# Altium project PFC_Evaluation_Board.PrjPcb
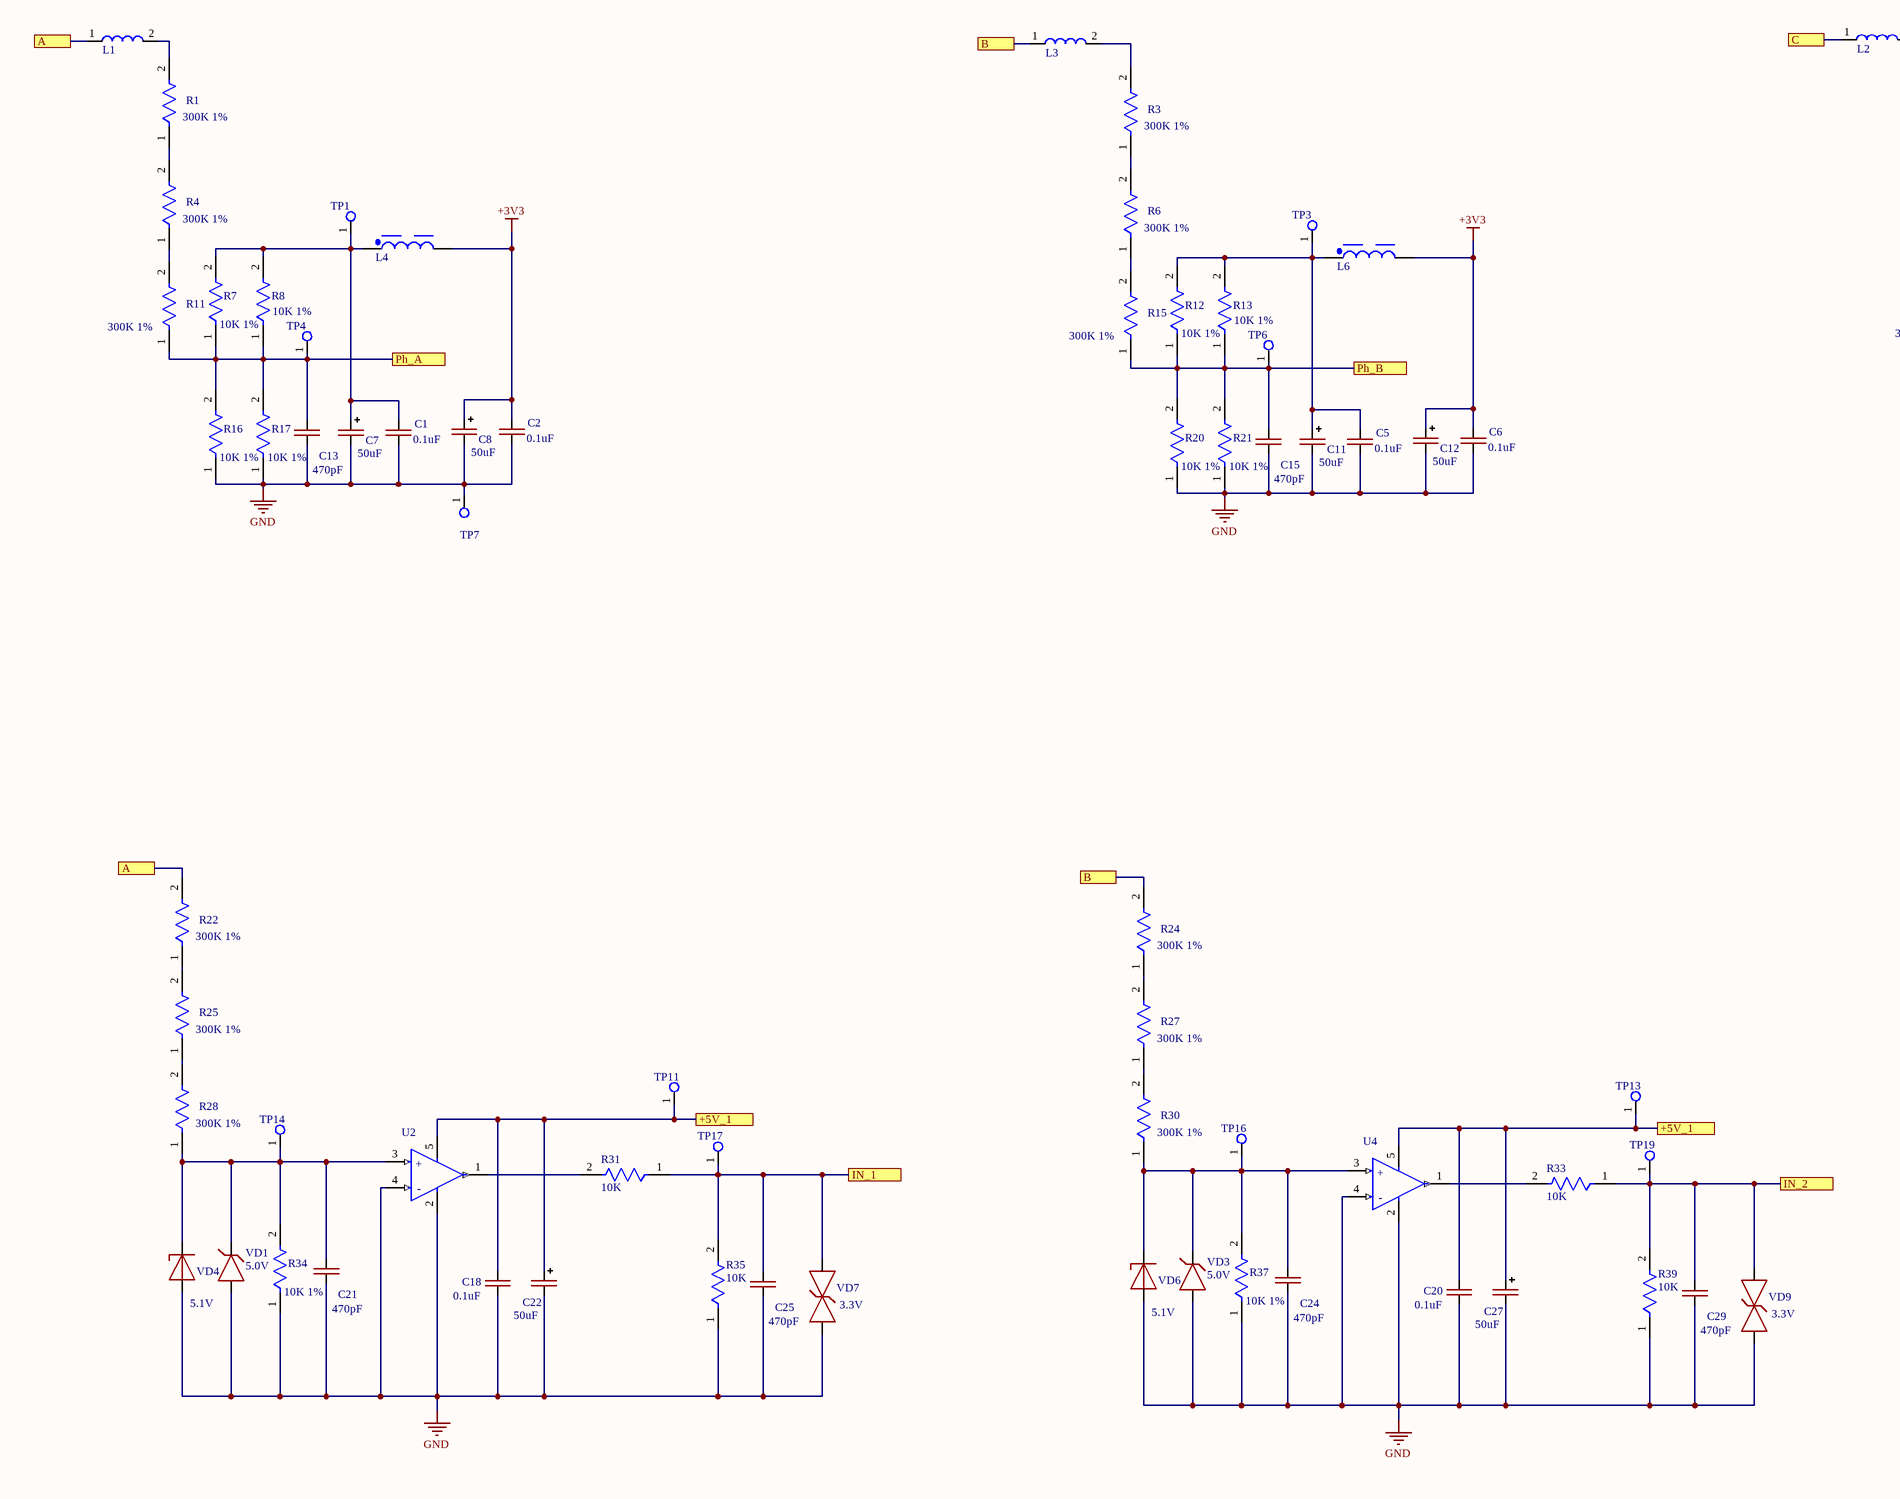
[diagram p0: Rectifire_(PFC)_Evaluation_Board.SchDoc, left]
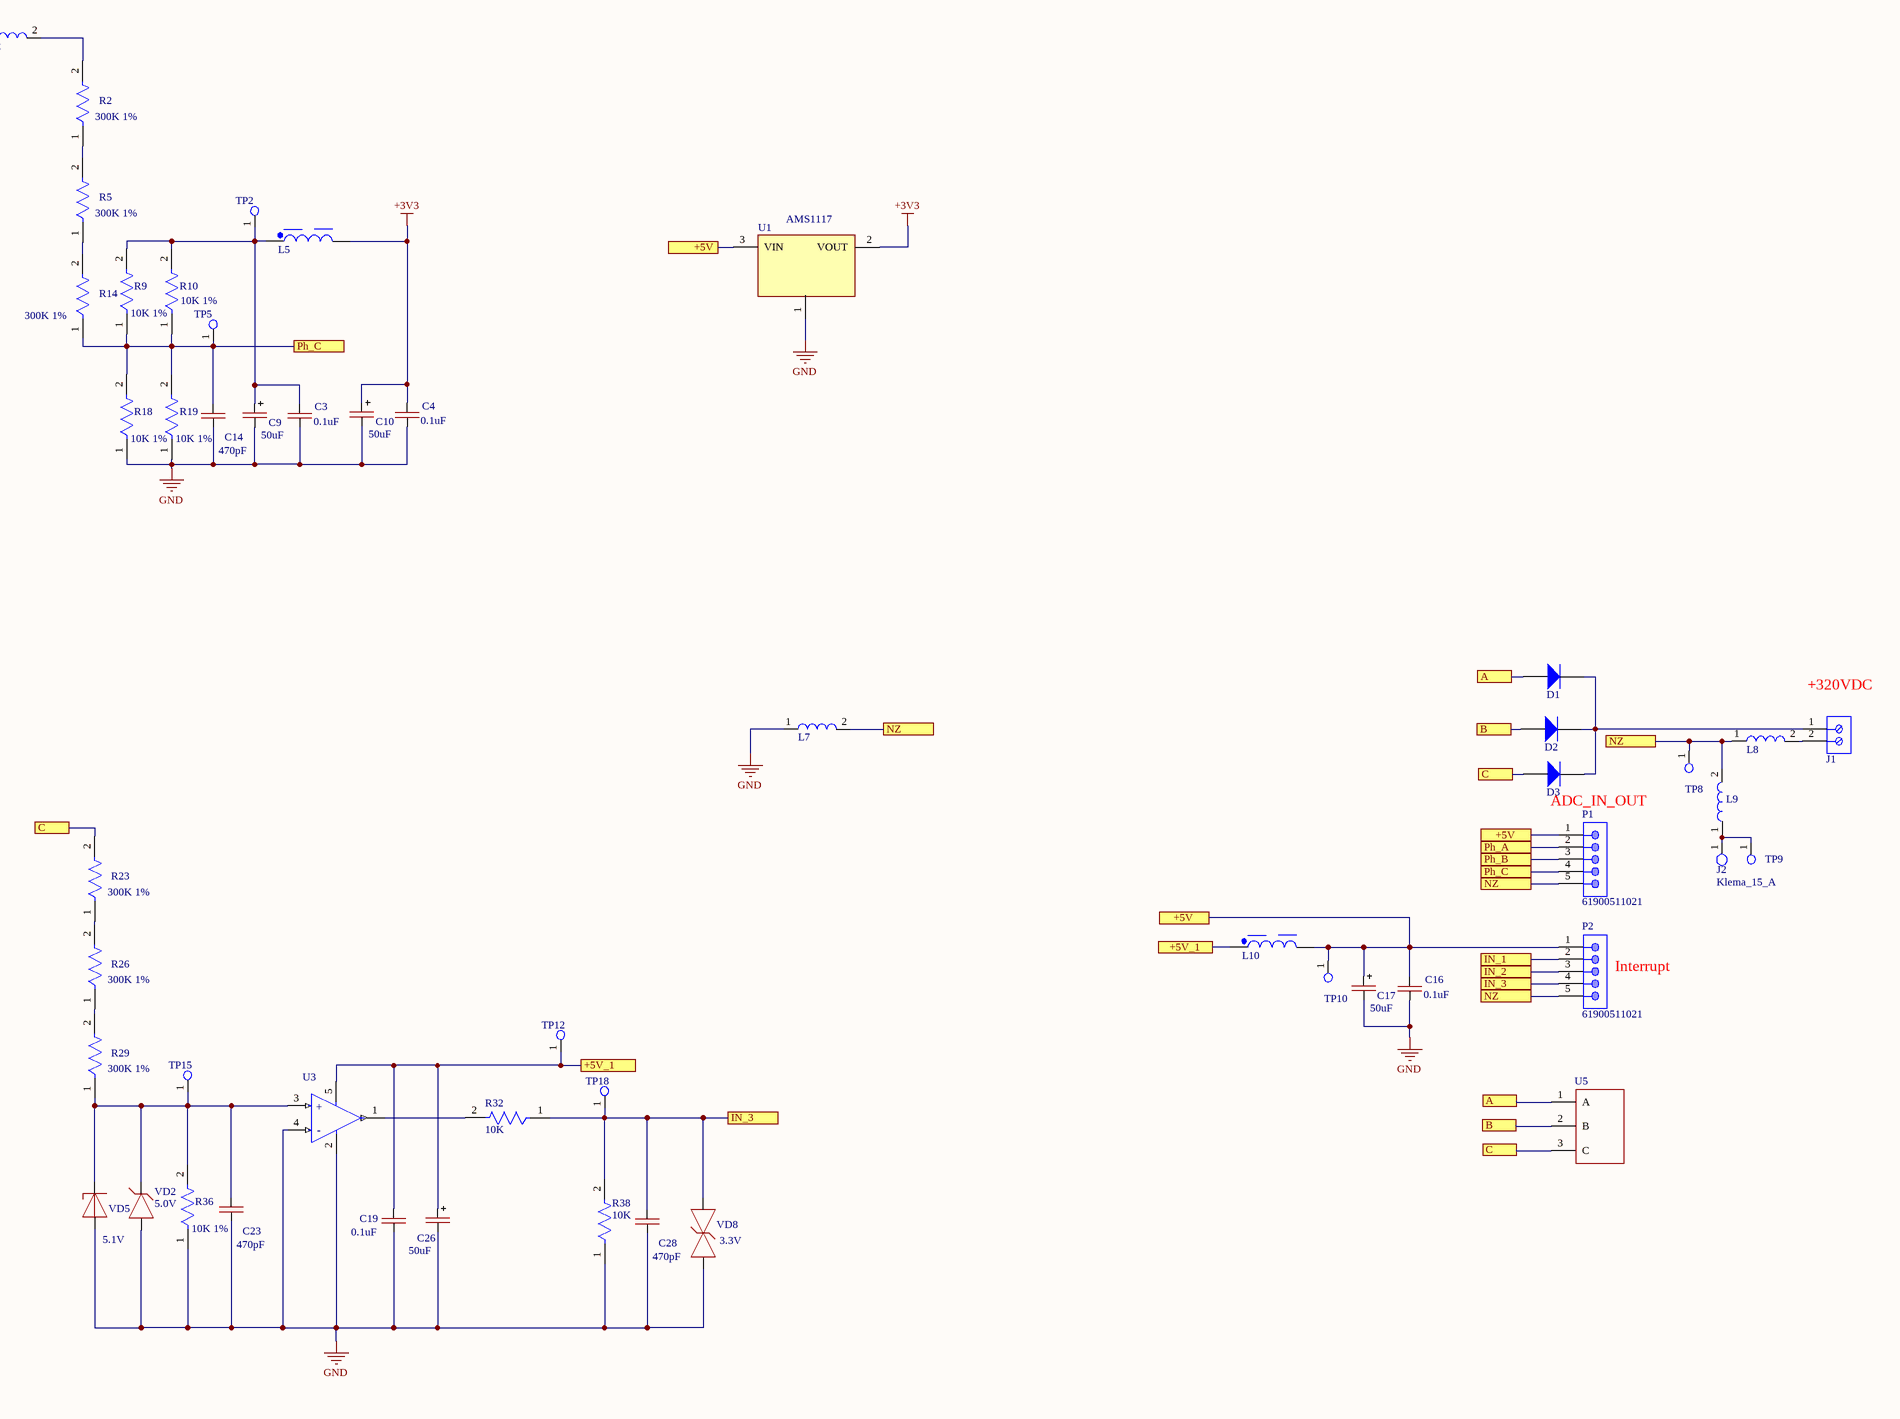
[diagram p1: Rectifire_(PFC)_Evaluation_Board.SchDoc, right]
1 sheet, 118 parts. Net scope: flat (ports and power ports of the same name join across sheets).
Board file: Rectifire_(PFC)_Evaluation_board.PcbDoc

## Sheet Rectifire_(PFC)_Evaluation_Board.SchDoc
size A1; SheetNumber: 1; SheetTotal: 1; SPICEModelCacheJLRIVHQE: <root> / <DocumentId>JLRIVHQE</DocumentId> / <CacheFrame Number="0"> / <Model Name="4532_744773112_12u" Kind="CKT"> / <Text>******* / .subckt 4532_744773112_12u 1 2 / Rp 1 2 21000 / Cp 1 2 2.27p / Rs 1 N3 0.156 / L1 N3 2 12u / .ends 4532_744773112_12u</Text> / </Model> / </CacheFrame> / </root>

### Parts
C1  0.1uF  [CAP-0805]
C2  0.1uF  [CAP-0805]
C3  0.1uF  [CAP-0805]
C4  0.1uF  [CAP-0805]
C5  0.1uF  [CAP-0805]
C6  0.1uF  [CAP-0805]
C7  50uF  [CAP-TAN-D]
C8  50uF  [CAP-TAN-D]
C9  50uF  [CAP-TAN-D]
C10  50uF  [CAP-TAN-D]
C11  50uF  [CAP-TAN-D]
C12  50uF  [CAP-TAN-D]
C13  470pF  [CAP-0805]
C14  470pF  [CAP-0805]
C15  470pF  [CAP-0805]
C16  0.1uF  [CAP-0805]
C17  50uF  [CAP-TAN-D]
C18  0.1uF  [CAP-0805]
C19  0.1uF  [CAP-0805]
C20  0.1uF  [CAP-0805]
C21  470pF  [CAP-0805]
C22  50uF  [CAP-TAN-D]
C23  470pF  [CAP-0805]
C24  470pF  [CAP-0805]
C25  470pF  [CAP-0805]
C26  50uF  [CAP-TAN-D]
C27  50uF  [CAP-TAN-D]
C28  470pF  [CAP-0805]
C29  470pF  [CAP-0805]
D1  FR-207  [FP-DO-201AD-MFG]  (value not drawn)
D2  FR-207  [FP-DO-201AD-MFG]  (value not drawn)
D3  FR-207  [FP-DO-201AD-MFG]  (value not drawn)
J1  691101710002  [691101710002]  (value not drawn)
J2  Klema_15_A  [Connector_6mm]
L1  Coil  [NR4030]  (value not drawn)
L2  Coil  [NR4030]  (value not drawn)
L3  Coil  [NR4030]  (value not drawn)
L4  12µH, 1.28A  [WE-PD2_4532]  (value not drawn)
L5  12µH, 1.28A  [WE-PD2_4532]  (value not drawn)
L6  12µH, 1.28A  [WE-PD2_4532]  (value not drawn)
L7  Coil  [NR4030]  (value not drawn)
L8  Coil  [NR4030]  (value not drawn)
L9  Coil  [NR4030]  (value not drawn)
L10  12µH, 1.28A  [WE-PD2_4532]  (value not drawn)
P1  61900511021  [61900511021]
P2  61900511021  [61900511021]
R1  300K 1%  [RES-1206]
R2  300K 1%  [RES-1206]
R3  300K 1%  [RES-1206]
R4  300K 1%  [RES-1206]
R5  300K 1%  [RES-1206]
R6  300K 1%  [RES-1206]
R7  10K 1%  [RES-1206]
R8  10K 1%  [RES-1206]
R9  10K 1%  [RES-1206]
R10  10K 1%  [RES-1206]
R11  300K 1%  [RES-1206]
R12  10K 1%  [RES-1206]
R13  10K 1%  [RES-1206]
R14  300K 1%  [RES-1206]
R15  300K 1%  [RES-1206]
R16  10K 1%  [RES-1206]
R17  10K 1%  [RES-1206]
R18  10K 1%  [RES-1206]
R19  10K 1%  [RES-1206]
R20  10K 1%  [RES-1206]
R21  10K 1%  [RES-1206]
R22  300K 1%  [RES-1206]
R23  300K 1%  [RES-1206]
R24  300K 1%  [RES-1206]
R25  300K 1%  [RES-1206]
R26  300K 1%  [RES-1206]
R27  300K 1%  [RES-1206]
R28  300K 1%  [RES-1206]
R29  300K 1%  [RES-1206]
R30  300K 1%  [RES-1206]
R31  10K  [RES-0805]
R32  10K  [RES-0805]
R33  10K  [RES-0805]
R34  10K 1%  [RES-1206]
R35  10K  [RES-0805]
R36  10K 1%  [RES-1206]
R37  10K 1%  [RES-1206]
R38  10K  [RES-0805]
R39  10K  [RES-0805]
TP1  Test_Point_PCB  [Test_Point]  (value not drawn)
TP2  Test_Point_PCB  [Test_Point]  (value not drawn)
TP3  Test_Point_PCB  [Test_Point]  (value not drawn)
TP4  Test_Point_PCB  [Test_Point]  (value not drawn)
TP5  Test_Point_PCB  [Test_Point]  (value not drawn)
TP6  Test_Point_PCB  [Test_Point]  (value not drawn)
TP7  Test_Point_PCB  [Pin_Test_Point(Pink)]  (value not drawn)
TP8  Test_Point_PCB  [Pin_Test_Point(Pink)]  (value not drawn)
TP9  Test_Point_PCB  [Pin_Test_Point(Pink)]  (value not drawn)
TP10  Test_Point_PCB  [Test_Point]  (value not drawn)
TP11  Test_Point_PCB  [Test_Point]  (value not drawn)
TP12  Test_Point_PCB  [Test_Point]  (value not drawn)
TP13  Test_Point_PCB  [Test_Point]  (value not drawn)
TP14  Test_Point_PCB  [Test_Point]  (value not drawn)
TP15  Test_Point_PCB  [Test_Point]  (value not drawn)
TP16  Test_Point_PCB  [Test_Point]  (value not drawn)
TP17  Test_Point_PCB  [Test_Point]  (value not drawn)
TP18  Test_Point_PCB  [Test_Point]  (value not drawn)
TP19  Test_Point_PCB  [Test_Point]  (value not drawn)
U1  AMS1117  [SOT-89]
U2  (no value)  [SOT-23-5]
U3  (no value)  [SOT-23-5]
U4  (no value)  [SOT-23-5]
U5  (no value)  [MDS100]
VD1  5.0V  [SOD-323]
VD2  5.0V  [SOD-323]
VD3  5.0V  [SOD-323]
VD4  5.1V  [DIOD-SOD123-2_V]
VD5  5.1V  [DIOD-SOD123-2_V]
VD6  5.1V  [DIOD-SOD123-2_V]
VD7  3.3V  [DO-214AA]
VD8  3.3V  [DO-214AA]
VD9  3.3V  [DO-214AA]

### Ports
+5V (see Rectifire_(PFC)_Evaluation_Board[8A], Rectifire_(PFC)_Evaluation_Board[10B]), +5V (see Rectifire_(PFC)_Evaluation_Board[8A], Rectifire_(PFC)_Evaluation_Board[11B]), +5V (see Rectifire_(PFC)_Evaluation_Board[10B], Rectifire_(PFC)_Evaluation_Board[11B]), +5V_1 (see Rectifire_(PFC)_Evaluation_Board[3B], Rectifire_(PFC)_Evaluation_Board[6B], Rectifire_(PFC)_Evaluation_Board[8B]), +5V_1 (see Rectifire_(PFC)_Evaluation_Board[3B], Rectifire_(PFC)_Evaluation_Board[6B], Rectifire_(PFC)_Evaluation_Board[10B]), +5V_1 (see Rectifire_(PFC)_Evaluation_Board[3B], Rectifire_(PFC)_Evaluation_Board[8B], Rectifire_(PFC)_Evaluation_Board[10B]), +5V_1 (see Rectifire_(PFC)_Evaluation_Board[6B], Rectifire_(PFC)_Evaluation_Board[8B], Rectifire_(PFC)_Evaluation_Board[10B]), A (see Rectifire_(PFC)_Evaluation_Board[1A], Rectifire_(PFC)_Evaluation_Board[1B], Rectifire_(PFC)_Evaluation_Board[11B]), A (see Rectifire_(PFC)_Evaluation_Board[1A], Rectifire_(PFC)_Evaluation_Board[11B]), A (see Rectifire_(PFC)_Evaluation_Board[1B], Rectifire_(PFC)_Evaluation_Board[11B]), B (see Rectifire_(PFC)_Evaluation_Board[4A], Rectifire_(PFC)_Evaluation_Board[4B], Rectifire_(PFC)_Evaluation_Board[11B]), B (see Rectifire_(PFC)_Evaluation_Board[4A], Rectifire_(PFC)_Evaluation_Board[4B], Rectifire_(PFC)_Evaluation_Board[11C]), B (see Rectifire_(PFC)_Evaluation_Board[4A], Rectifire_(PFC)_Evaluation_Board[11B], Rectifire_(PFC)_Evaluation_Board[11C]), B (see Rectifire_(PFC)_Evaluation_Board[4B], Rectifire_(PFC)_Evaluation_Board[11B], Rectifire_(PFC)_Evaluation_Board[11C]), C (see Rectifire_(PFC)_Evaluation_Board[6A], Rectifire_(PFC)_Evaluation_Board[6B], Rectifire_(PFC)_Evaluation_Board[11B]), C (see Rectifire_(PFC)_Evaluation_Board[6A], Rectifire_(PFC)_Evaluation_Board[6B], Rectifire_(PFC)_Evaluation_Board[11C]), C (see Rectifire_(PFC)_Evaluation_Board[6A], Rectifire_(PFC)_Evaluation_Board[11B], Rectifire_(PFC)_Evaluation_Board[11C]), C (see Rectifire_(PFC)_Evaluation_Board[6B], Rectifire_(PFC)_Evaluation_Board[11B], Rectifire_(PFC)_Evaluation_Board[11C]), IN_1 (see Rectifire_(PFC)_Evaluation_Board[3C]), IN_1 (see Rectifire_(PFC)_Evaluation_Board[11B]), IN_2 (see Rectifire_(PFC)_Evaluation_Board[6C]), IN_2 (see Rectifire_(PFC)_Evaluation_Board[11B]), IN_3 (see Rectifire_(PFC)_Evaluation_Board[9C]), IN_3 (see Rectifire_(PFC)_Evaluation_Board[11B]), NZ (see Rectifire_(PFC)_Evaluation_Board[9B], Rectifire_(PFC)_Evaluation_Board[11B]), NZ (see Rectifire_(PFC)_Evaluation_Board[11B]), Ph_A (see Rectifire_(PFC)_Evaluation_Board[2A]), Ph_A (see Rectifire_(PFC)_Evaluation_Board[11B]), Ph_B (see Rectifire_(PFC)_Evaluation_Board[5A]), Ph_B (see Rectifire_(PFC)_Evaluation_Board[11B]), Ph_C (see Rectifire_(PFC)_Evaluation_Board[7A]), Ph_C (see Rectifire_(PFC)_Evaluation_Board[11B])

### Nets
+3V3: C2.2 C4.2 C6.2 C8.1(+) C10.1(+) C12.1(+) L4.2 L5.2 L6.2 U1.2(VOUT)
GND: C1.1 C2.1 C3.1 C4.1 C5.1 C6.1 C7.2(-) C8.2(-) C9.2(-) C10.2(-) C11.2(-) C12.2(-) C13.1 C14.1 C15.1 C16.1 C17.2(-) C18.1 C19.1 C20.1 C21.1 C22.2(-) C23.1 C24.1 C25.1 C26.2(-) C27.2(-) C28.1 C29.1 L7.1 R16.1 R17.1 R18.1 R19.1 R20.1 R21.1 R34.1 R35.1 R36.1 R37.1 R38.1 R39.1 TP7.1(G9) U1.1(Ground) U2.2(VSS) U2.4(VIN-) U3.2(VSS) U3.4(VIN-) U4.2(VSS) U4.4(VIN-) VD1.1(A) VD2.1(A) VD3.1(A) VD4.2(A) VD5.2(A) VD6.2(A) VD7.1(C) VD8.1(C) VD9.1(C)
NetC1_2: C1.2 C7.1(+) L4.1 R7.2 R8.2 TP1.1(G9)
NetC3_2: C3.2 C9.1(+) L5.1 R9.2 R10.2 TP2.1(G9)
NetC5_2: C5.2 C11.1(+) L6.1 R12.2 R13.2 TP3.1(G9)
NetC13_2: C13.2 P1.2 R7.1 R8.1 R11.1 R16.2 R17.2 TP4.1(G9) ; port Ph_A
NetC14_2: C14.2 P1.4 R9.1 R10.1 R14.1 R18.2 R19.2 TP5.1(G9) ; port Ph_C
NetC15_2: C15.2 P1.3 R12.1 R13.1 R15.1 R20.2 R21.2 TP6.1(G9) ; port Ph_B
NetC16_2: C16.2 C17.1(+) L10.2 P1.1 P2.1 TP10.1(G9) U1.3(VIN) ; port +5V
NetC18_2: C18.2 C19.2 C20.2 C22.1(+) C26.1(+) C27.1(+) L10.1 TP11.1(G9) TP12.1(G9) TP13.1(G9) U2.5(VDD) U3.5(VDD) U4.5(VDD) ; port +5V_1
NetC21_2: C21.2 R28.1 R34.2 TP14.1(G9) U2.3(VIN+) VD1.2(C) VD4.1(C)
NetC23_2: C23.2 R29.1 R36.2 TP15.1(G9) U3.3(VIN+) VD2.2(C) VD5.1(C)
NetC24_2: C24.2 R30.1 R37.2 TP16.1(G9) U4.3(VIN+) VD3.2(C) VD6.1(C)
NetC25_2: C25.2 P2.2 R31.1 R35.2 TP17.1(G9) VD7.2(A) ; port IN_1
NetC28_2: C28.2 P2.4 R32.1 R38.2 TP18.1(G9) VD8.2(A) ; port IN_3
NetC29_2: C29.2 P2.3 R33.1 R39.2 TP19.1(G9) VD9.2(A) ; port IN_2
NetD1_1: D1.1(K) D2.1(K) D3.1(K) J1.1
NetD1_2: D1.2(A) L1.1 R22.2 U5.1(A) ; port A
NetD2_2: D2.2(A) L3.1 R24.2 U5.2(B) ; port B
NetD3_2: D3.2(A) L2.1 R23.2 U5.3(C) ; port C
NetJ1_2: J1.2 L8.2
NetJ2_1: J2.1 L9.1 TP9.1(G9)
NetL1_2: L1.2 R1.2
NetL2_2: L2.2 R2.2
NetL3_2: L3.2 R3.2
NetL7_2: L7.2 L8.1 L9.2 P1.5 P2.5 TP8.1(G9) ; port NZ
NetR1_1: R1.1 R4.2
NetR2_1: R2.1 R5.2
NetR3_1: R3.1 R6.2
NetR4_1: R4.1 R11.2
NetR5_1: R5.1 R14.2
NetR6_1: R6.1 R15.2
NetR22_1: R22.1 R25.2
NetR23_1: R23.1 R26.2
NetR24_1: R24.1 R27.2
NetR25_1: R25.1 R28.2
NetR26_1: R26.1 R29.2
NetR27_1: R27.1 R30.2
NetR31_2: R31.2 U2.1(VOUT)
NetR32_2: R32.2 U3.1(VOUT)
NetR33_2: R33.2 U4.1(VOUT)

### Notes on the sheet
- +320VDC
- ADC_IN_OUT
- (near P2) Interrupt
- (in symbol MCP6001T) +; -

### Library data of the parts
C1-C6 C13-C16 C18-C21 C23-C25 C28 C29 = CAP-NON-POLAR
C7-C12 C17 C22 C26 C27 = CAP-POLAR
D1-D3 = FR-207: FR207
J1 = 691101710002: WR-TBL Series 101 Horizontal Entry Modular, THT, pitch 5mm, 2p; Manufacturer: Wurth Elektronik; Modularity: Yes; Rated Current: 16A; Working Voltage: 250V; ComponentLink1Description: Website Link; ComponentLink1URL: https://www.we-online.com/redexpert/article/691101710002?ad; ComponentLink2Description: Datasheet Link; ComponentLink2URL: https://www.we-online.com/redexpert/spec/691101710002?ad; Manufacturer Part Number: 691101710002; Category: Terminal Blocks; Match Code: WR-TBL; Mount: Through Hole; Operating Temperature Max: 105°C; Operating Temperature Min: -40°C; Packaging: Box; Application: Pressure Clamp; Number of Pins: 2; Number of Rows: 1; Orientation: Horizontal; Pitch: 5mm
L4-L6 L10 = 744773112: WE-PD2 SMT Power Inductor, size 4532, 12µH, 1.28A, 0.21Ω; Manufacturer: Wurth Elektronik; Case/Size Code: 4532; DC Resistance: 0.156Ω; Saturation Current: 1.62A; Self Resonant Frequency: 32MHz; Manufacturer Part Number: 744773112; Category: Unshielded Power Inductors; Match Code: WE-PD2; ComponentLink1Description: Website Link; ComponentLink1URL: https://www.we-online.com/redexpert/article/744773112?ad; ComponentLink2Description: Datasheet Link; ComponentLink2URL: https://www.we-online.com/redexpert/spec/744773112?ad; Mount: Surface Mount; Operating Temperature Max: 125°C; Operating Temperature Min: -40°C; Packaging: Tape and Reel; Length: 4.5mm; Width: 4mm; Height: 3.2mm; DC Resistance Max: 0.21Ω; Inductance: 12µH; Rated Current: 1.28A
P1 P2 = 61900511021: WR-WTB THT Male Left Angled Bottom Locking Header, pitch 2.54mm, 5p; Pin Number: 5; Contact Resistance: 20mOhm; Rated Current: 3A; Withstanding Voltage: 1000VAC; Working Voltage: 250VAC; ComponentLink1Description: Manufacturer; ComponentLink1URL: http://www.we-online.de; ComponentLink2Description: Datasheet; ComponentLink2URL: https://www.we-online.com/catalog/datasheet/61900511021.pdf; Pitch: 2.54mm; Published Date: January 2020; Publisher: Wurth Elektronik; Mounting Technology: THT; Packaging: Bag; Operating Temperature: -40 to +105degC; Part Number: 61900511021; Gender: Male; Type: Right Angled Bottom Locking
R1-R6 R11 R14 R15 R22-R30 = RES-CONST: 300K
R7 R9 R12 R31-R39 = RES-CONST
R8 R10 R13 R16-R21 = RES-CONST: 10K
TP1-TP19 = TP_PCB?: Test_Point
U2-U4 = MCP6001T: IC OPAMP GP 1 CIRCUIT SOT23-5; Number of Amplifiers: 1; Voltage: 6V; Power Supply Rejection Ratio (PSRR): 86dB; Common Mode Rejection Ratio: 60dB; Unity Gain Bandwidth Product: 1MHz; Slew Rate: 0.6V/µs; Output Current per Channel: 23mA; Nominal Supply Current: 100uA; Input Offset Voltage (Vos): 4.5mV; Input Bias Current: 1pA; Operating Supply Voltage: 5.5V; Min Supply Voltage: 1.8V; Voltage Gain: 112dB; Length: 3.1mm; REACH SVHC: No SVHC; Number of Pins: 5; Package Quantity: 1; Radiation Hardening: No; Mount: Surface Mount; Number of Circuits: 1; Number of Elements: 1; Output Current: 23mA; Packaging: Tape and Reel; Height: 1.3mm; Lead Free: Lead Free; Min Operating Temperature: -40°C; Bandwidth: 1MHz; Contact Plating: Tin; Max Supply Voltage: 6V; Max Operating Temperature: 85°C; Width: 1.8mm; Case/Package: SOT-23; Operating Supply Current: 100uA; Number of Channels: 1; Gain Bandwidth Product: 1MHz
U5 = MDS100: Gain Bandwidth Product: 1MHz; Number of Circuits: 2; Min Supply Voltage: 3V; Slew Rate: 0.6V/µs; Max Dual Supply Voltage: 16V; Common Mode Rejection Ratio: 65dB; Input Bias Current: 250nA; Min Dual Supply Voltage: 1.5V; Dual Supply Voltage: 9V; Operating Supply Current: 1.5mA; Output Current: 40mA; Input Offset Voltage (Vos): 7mV; Nominal Supply Current: 1.2mA; Voltage Gain: 100dB; Max Supply Voltage: 32V; Width: 4mm; Number of Pins: 8; Min Operating Temperature: 0°C; REACH SVHC: No SVHC; Contact Plating: Tin; Lead Free: Lead Free; Halogen Free: Halogen Free; Power Supply Rejection Ratio (PSRR): 65dB; Operating Supply Voltage: 16V; Package Quantity: 2500; Max Operating Temperature: 70°C; Case/Package: SOIC; Height: 1.5mm; Packaging: Tape and Reel; Radiation Hardening: No; Number of Channels: 2; Bandwidth: 1MHz; Length: 5mm; Number of Elements: 2; Number of Amplifiers: 2; Output Current per Channel: 40mA
VD1-VD3 = SMBJ15A
VD4-VD6 = ZENER
VD7-VD9 = Suppressor